# EAGLE design Hardware-Neuron (EAGLE 9.3.0)
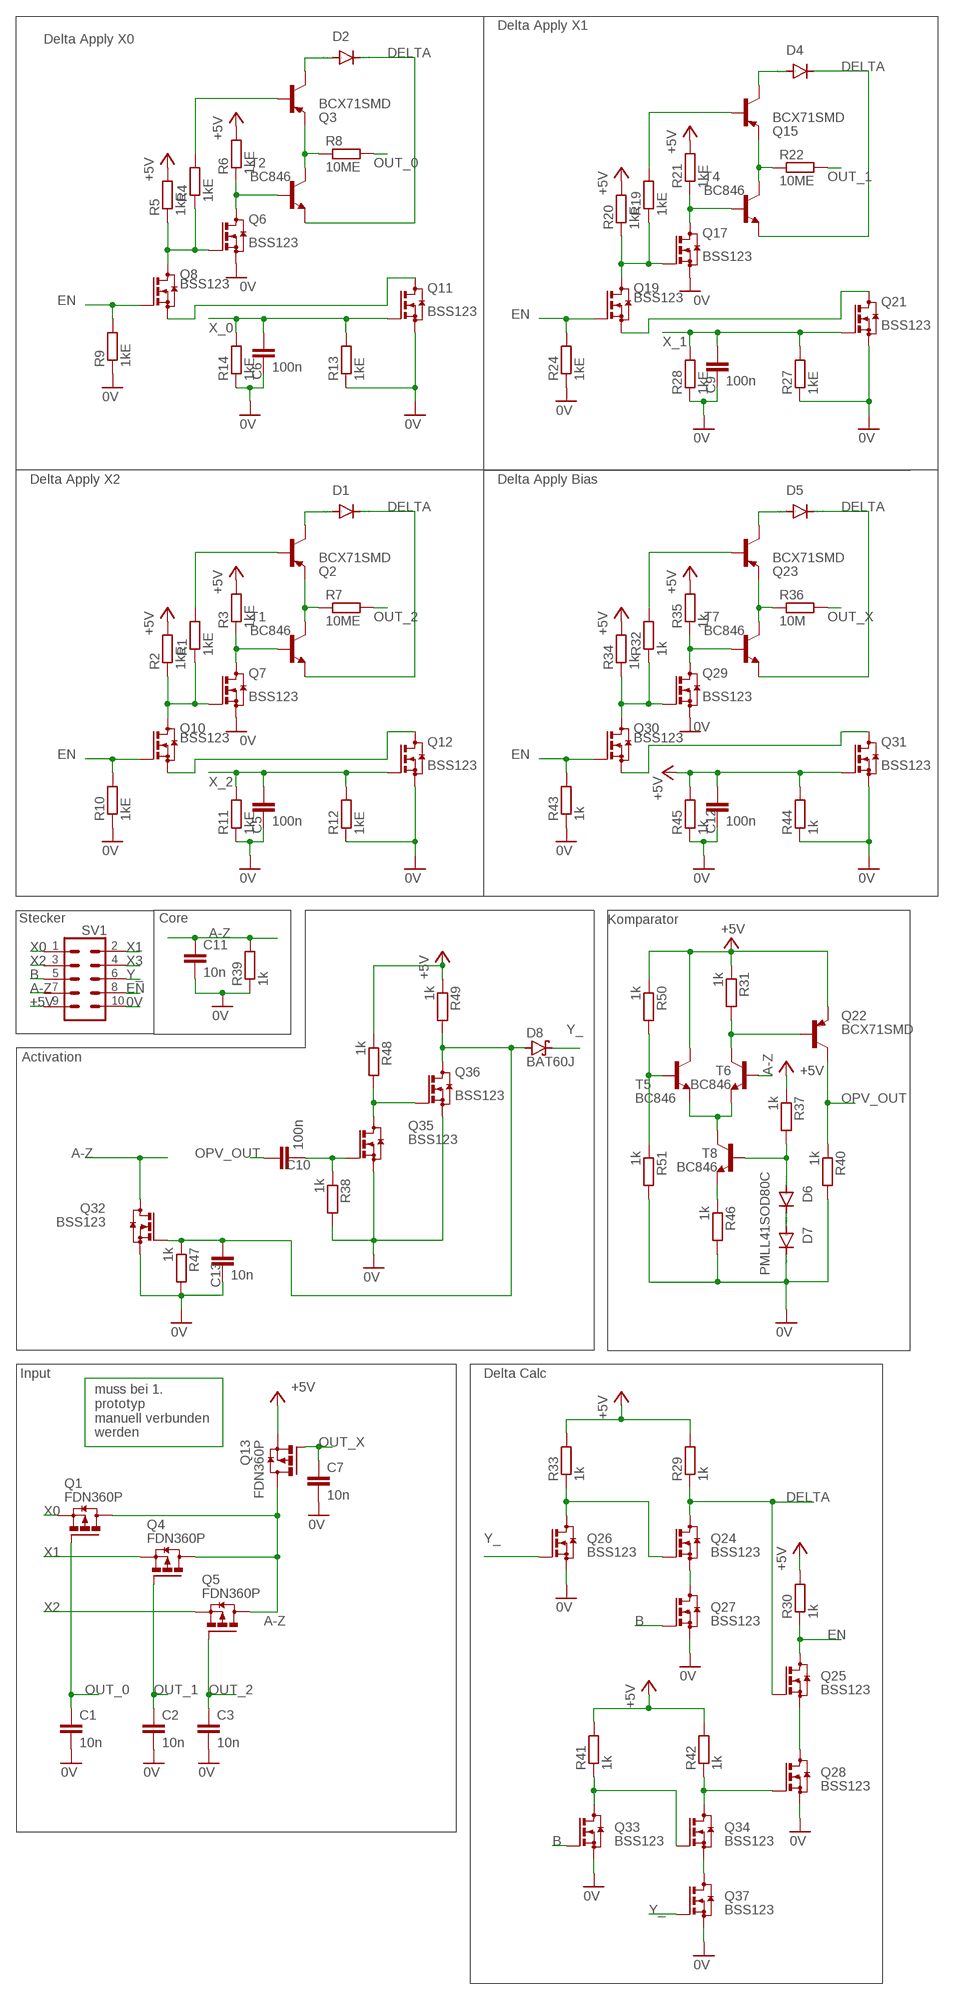
[diagram p0: schematic, sheet 1]

## Parts
C1  10n  C-EUC0805  [C0805]
C2  10n  C-EUC0805  [C0805]
C3  10n  C-EUC0805  [C0805]
C5  100n  C-EUC0805  [C0805]
C6  100n  C-EUC0805  [C0805]
C7  10n  C-EUC0805  [C0805]
C9  100n  C-EUC0805  [C0805]
C10  100n  C-EUC0805  [C0805]
C11  10n  C-EUC0805  [C0805]
C12  100n  C-EUC0805  [C0805]
C13  10n  C-EUC0805  [C0805]
D1  PMLL41SOD80C  [SOD80C]
D2  PMLL41SOD80C  [SOD80C]
D4  PMLL41SOD80C  [SOD80C]
D5  PMLL41SOD80C  [SOD80C]
D6  PMLL41SOD80C  [SOD80C]
D7  PMLL41SOD80C  [SOD80C]
D8  BAT60J  [SOD323_ST]
Q1  FDN360P  [SUPER-SOT3]
Q2  BCX71SMD  [SOT23]
Q3  BCX71SMD  [SOT23]
Q4  FDN360P  [SUPER-SOT3]
Q5  FDN360P  [SUPER-SOT3]
Q6  BSS123  [SOT23]
Q7  BSS123  [SOT23]
Q8  BSS123  [SOT23]
Q10  BSS123  [SOT23]
Q11  BSS123  [SOT23]
Q12  BSS123  [SOT23]
Q13  FDN360P  [SUPER-SOT3]
Q15  BCX71SMD  [SOT23]
Q17  BSS123  [SOT23]
Q19  BSS123  [SOT23]
Q21  BSS123  [SOT23]
Q22  BCX71SMD  [SOT23]
Q23  BCX71SMD  [SOT23]
Q24  BSS123  [SOT23]
Q25  BSS123  [SOT23]
Q26  BSS123  [SOT23]
Q27  BSS123  [SOT23]
Q28  BSS123  [SOT23]
Q29  BSS123  [SOT23]
Q30  BSS123  [SOT23]
Q31  BSS123  [SOT23]
Q32  BSS123  [SOT23]
Q33  BSS123  [SOT23]
Q34  BSS123  [SOT23]
Q35  BSS123  [SOT23]
Q36  BSS123  [SOT23]
Q37  BSS123  [SOT23]
R1  1kE  R-EU_M0805  [M0805]
R2  1kE  R-EU_M0805  [M0805]
R3  1kE  R-EU_M0805  [M0805]
R4  1kE  R-EU_M0805  [M0805]
R5  1kE  R-EU_M0805  [M0805]
R6  1kE  R-EU_M0805  [M0805]
R7  10ME  R-EU_M0805  [M0805]
R8  10ME  R-EU_M0805  [M0805]
R9  1kE  R-EU_M0805  [M0805]
R10  1kE  R-EU_M0805  [M0805]
R11  1kE  R-EU_M0805  [M0805]
R12  1kE  R-EU_M0805  [M0805]
R13  1kE  R-EU_M0805  [M0805]
R14  1kE  R-EU_M0805  [M0805]
R19  1kE  R-EU_M0805  [M0805]
R20  1kE  R-EU_M0805  [M0805]
R21  1kE  R-EU_M0805  [M0805]
R22  10ME  R-EU_M0805  [M0805]
R24  1kE  R-EU_M0805  [M0805]
R27  1kE  R-EU_M0805  [M0805]
R28  1kE  R-EU_M0805  [M0805]
R29  1k  R-EU_M0805  [M0805]
R30  1k  R-EU_M0805  [M0805]
R31  1k  R-EU_M0805  [M0805]
R32  1k  R-EU_M0805  [M0805]
R33  1k  R-EU_M0805  [M0805]
R34  1k  R-EU_M0805  [M0805]
R35  1k  R-EU_M0805  [M0805]
R36  10M  R-EU_M0805  [M0805]
R37  1k  R-EU_M0805  [M0805]
R38  1k  R-EU_M0805  [M0805]
R39  1k  R-EU_M0805  [M0805]
R40  1k  R-EU_M0805  [M0805]
R41  1k  R-EU_M0805  [M0805]
R42  1k  R-EU_M0805  [M0805]
R43  1k  R-EU_M0805  [M0805]
R44  1k  R-EU_M0805  [M0805]
R45  1k  R-EU_M0805  [M0805]
R46  1k  R-EU_M0805  [M0805]
R47  1k  R-EU_M0805  [M0805]
R48  1k  R-EU_M0805  [M0805]
R49  1k  R-EU_M0805  [M0805]
R50  1k  R-EU_M0805  [M0805]
R51  1k  R-EU_M0805  [M0805]
SV1  ML10  [ML10]
T1  BC846  [SOT23]
T2  BC846  [SOT23]
T4  BC846  [SOT23]
T5  BC846  [SOT23]
T6  BC846  [SOT23]
T7  BC846  [SOT23]
T8  BC846  [SOT23]

## Nets
0V: C1.2 C2.2 C3.2 C5.2 C6.2 C7.2 C9.2 C11.2 C12.2 C13.2 D7.C Q6.2(S) Q7.2(S) Q11.2(S) Q12.2(S) Q17.2(S) Q21.2(S) Q26.2(S) Q27.2(S) Q28.2(S) Q29.2(S) Q31.2(S) Q32.2(S) Q33.2(S) Q35.2(S) Q36.2(S) Q37.2(S) R9.1 R10.1 R11.1 R12.1 R13.1 R14.1 R24.1 R27.1 R28.1 R38.2 R39.1 R40.2 R43.1 R44.1 R45.1 R46.2 R47.2 R51.2 SV1.10
+5V: C12.1 Q13.2(S) Q22.2(E) Q31.1(G) R2.2 R3.2 R5.2 R6.2 R20.2 R21.2 R29.2 R30.2 R31.1 R33.2 R34.2 R35.2 R37.1 R41.2 R42.2 R44.2 R45.2 R48.1 R49.1 R50.1 SV1.9 T5.3(C)
A-Z: C11.1 Q1.3(D) Q4.3(D) Q5.3(D) Q13.3(D) Q32.3(D) R39.2 SV1.7 T6.1(B)
B: Q27.1(G) Q33.1(G) SV1.5
DELTA: D1.C D2.C D4.C D5.C Q24.3(D) Q25.1(G) R29.1 T1.2(E) T2.2(E) T4.2(E) T7.2(E)
EN: Q8.1(G) Q10.1(G) Q19.1(G) Q25.3(D) Q30.1(G) R9.2 R10.2 R24.2 R30.1 R43.2 SV1.8
N$1: Q29.3(D) R35.1 T7.1(B)
N$2: Q23.2(E) R36.1 T7.3(C)
N$3: C10.2 Q35.1(G) R38.1
N$5: Q35.3(D) Q36.1(G) R48.2
N$6: Q6.3(D) R6.1 T2.1(B)
N$7: Q8.2(S) Q11.3(D)
N$8: Q3.2(E) R8.1 T2.3(C)
N$9: D5.A Q23.3(C)
N$10: Q23.1(B) R32.2
N$11: Q29.1(G) Q30.3(D) R32.1 R34.1
N$12: Q30.2(S) Q31.3(D)
N$13: D6.C D7.A
N$14: R50.2 R51.1 T5.1(B)
N$16: C13.1 D8.A Q32.1(G) Q36.3(D) R47.1 R49.2
N$25: R46.1 T8.2(E)
N$26: Q22.1(B) R31.2 T6.3(C)
N$27: T5.2(E) T6.2(E) T8.3(C)
N$28: Q17.3(D) R21.1 T4.1(B)
N$29: D6.A R37.2 T8.1(B)
N$30: Q24.1(G) Q26.3(D) R33.1
N$31: D2.A Q3.3(C)
N$32: Q24.2(S) Q27.3(D)
N$33: Q15.2(E) R22.1 T4.3(C)
N$34: Q3.1(B) R4.2
N$35: Q6.1(G) Q8.3(D) R4.1 R5.1
N$36: Q28.1(G) Q34.3(D) R42.1
N$37: Q33.3(D) Q34.1(G) R41.1
N$38: D4.A Q15.3(C)
N$39: Q15.1(B) R19.2
N$40: Q25.2(S) Q28.3(D)
N$41: Q17.1(G) Q19.3(D) R19.1 R20.1
N$42: Q19.2(S) Q21.3(D)
N$43: Q34.2(S) Q37.3(D)
N$50: Q7.3(D) R3.1 T1.1(B)
N$51: Q2.2(E) R7.1 T1.3(C)
N$52: D1.A Q2.3(C)
N$53: Q2.1(B) R1.2
N$54: Q7.1(G) Q10.3(D) R1.1 R2.1
N$55: Q10.2(S) Q12.3(D)
OPV_OUT: C10.1 Q22.3(C) R40.1
OUT_0: C1.1 Q1.1(G) R8.2
OUT_1: C2.1 Q4.1(G) R22.2
OUT_2: C3.1 Q5.1(G) R7.2
OUT_X: C7.1 Q13.1(G) R36.2
X0: Q1.2(S) SV1.1
X1: Q4.2(S) SV1.2
X2: Q5.2(S) SV1.3
X3: SV1.4
X_0: C6.1 Q11.1(G) R13.2 R14.2
X_1: C9.1 Q21.1(G) R27.2 R28.2
X_2: C5.1 Q12.1(G) R11.2 R12.2
Y_: D8.C Q26.1(G) Q37.1(G) SV1.6

## Notes on the sheet
- Delta Apply X1
- Delta Apply X0
- Delta Apply X2 | Delta Apply Bias
- Stecker | Core | Komparator
- Activation
- Input | Delta Calc
- muss bei 1.
  prototyp 
  manuell verbunden
  werden

## Library data of the parts
C1-C3 C5-C7 C9-C13 = rcl:C-EU: CAPACITOR, European symbol; SPICEPREFIX: C
D1 D2 D4-D7 = diode:PMLL41*: High-speed diodes Source: http://www.semiconductors.philips.com/acrobat_download/datasheets/PMLL4150_2.pdf
D8 = diode:BAT60J: Schottky barrier diode Source: www.st.com, BAT60J.pdf
Q1 Q4 Q5 Q13 = transistor-power:FDN360P: Single P-Channel, PowerTrench (R) MOSFET Source: http://www.fairchildsemi.com/ds/FD/FDN360P.pdf
Q2 Q3 Q15 Q22 Q23 = transistor-pnp:BCX71SMD: PNP Transistor
Q6-Q8 Q10-Q12 Q17 Q19 Q21 Q24-Q37 = transistor-small-signal:BSS123: N-CHANNEL MOS FET
R1-R14 R19-R22 R24 R27-R51 = rcl:R-EU_: RESISTOR, European symbol; SPICEPREFIX: R
SV1 = con-harting-ml:ML10: HARTING; OC_FARNELL: unknown; OC_NEWARK: unknown
T1 T2 T4-T8 = transistor:BC846: NPN TRANSISTOR

## Board
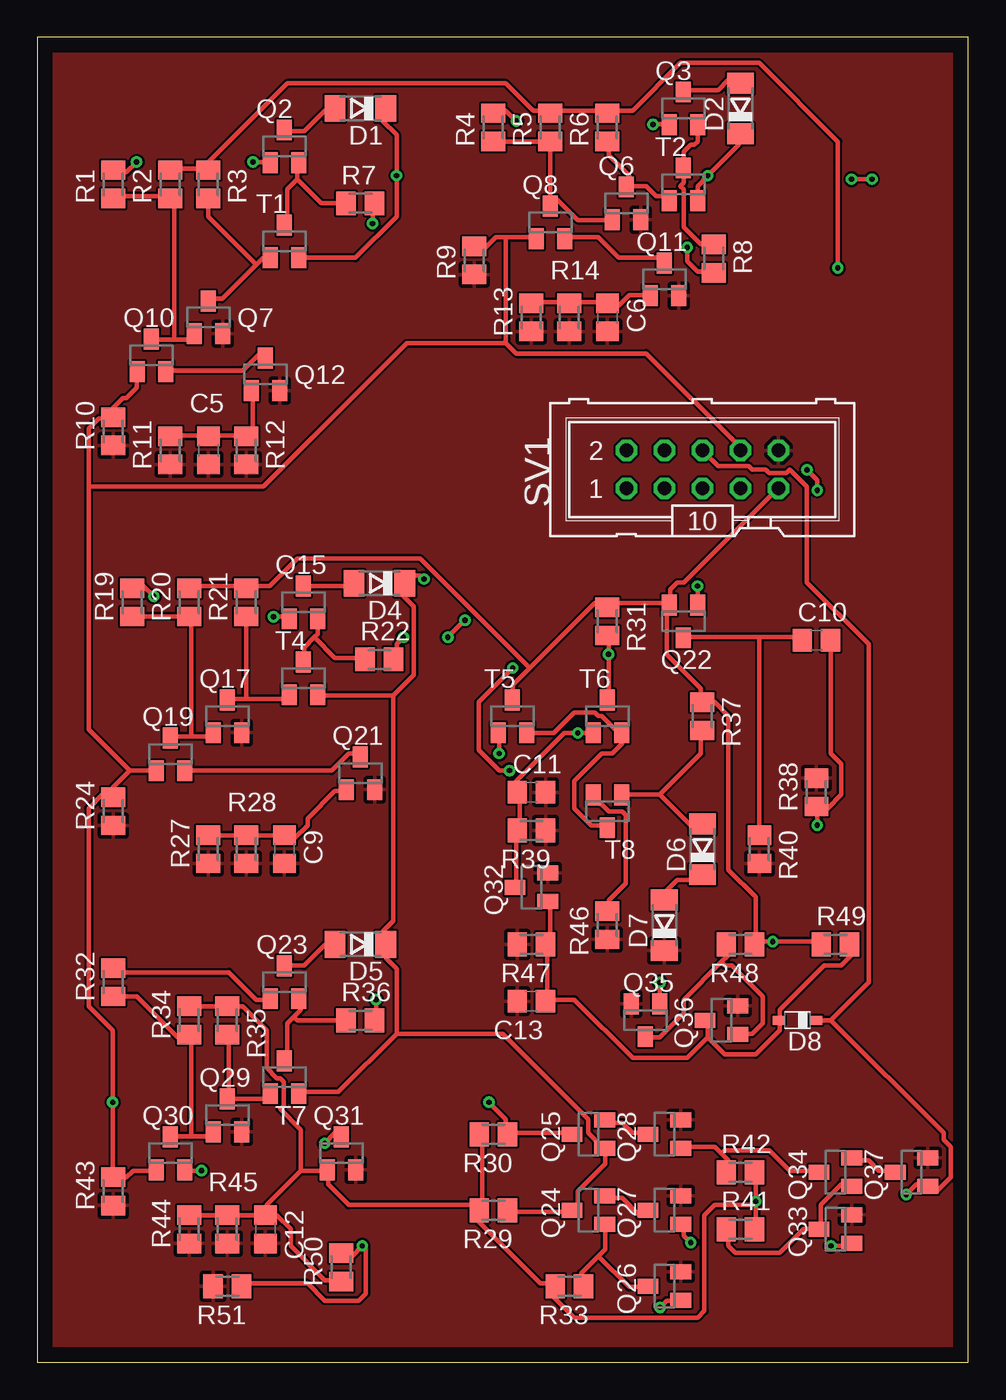
[diagram p1: board, top side]
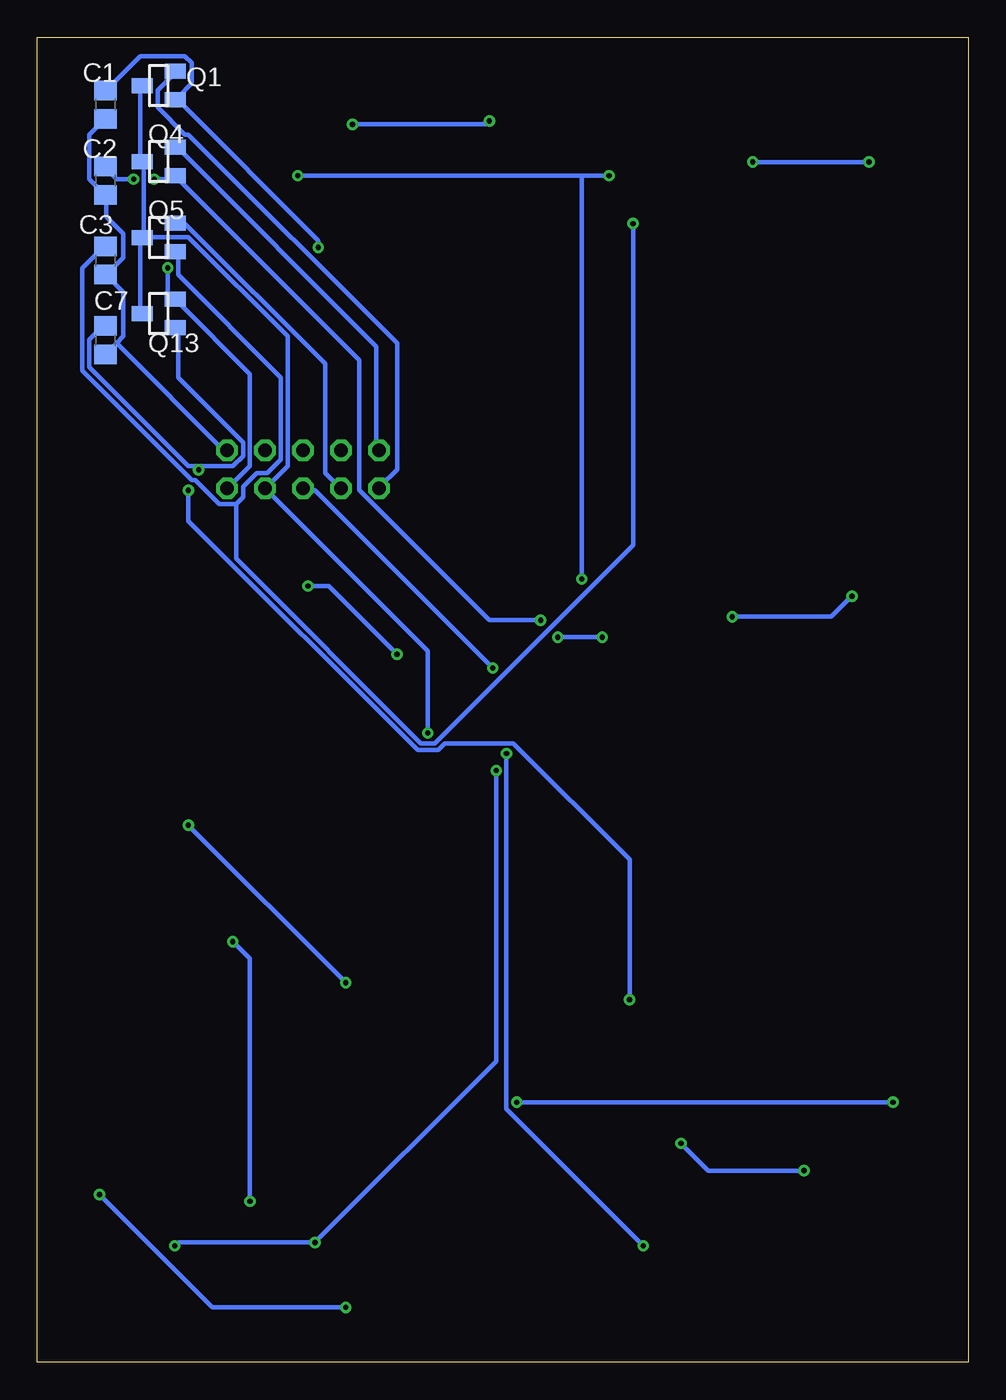
[diagram p2: board, bottom side, seen from below]

Size 62.21 x 88.57 mm. Coordinates in mm from the lower left corner, seen from the top.
Outline: 0,0 62.21,0 62.21,88.57 0,88.57 0,0
Copper layers (1*16): Top 0.035mm / dielectric 1.5mm / Bottom 0.035mm
Design rules "default *": minimum track width 12mil, minimum drill 0.35mm, track to track 6mil, track to pad 6mil, pad to pad 6mil, via to via 6mil, smd to smd 6mil, copper to edge 40mil, drill to drill 6mil, minimum pad ring 10mil, minimum via ring 8mil, stop-mask expansion 4mil, vias tented up to drill 0mil, thermal gap 10mil

### Footprints (pad centres in the part's own frame; a part is rotated, then mirrored left to right if it is on the bottom)
C0805 = smd 1.3 x 1.5: 1 -0.95,0; 2 0.95,0
SOD80C = smd 1.4 x 1.8: A 1.7,0; C -1.7,0
SOD323_ST = smd 0.8 x 0.6: A 1.25,0; C -1.25,0
SUPER-SOT3 = smd 1 x 1.4: 1 -0.95,-1.1; 2 0.95,-1.1; 3 0,1.1
SOT23 = smd 1 x 1.4: 1 -0.95,-1.1; 2 0.95,-1.1; 3 0,1.1
M0805 = smd 1.3 x 1.6: 1 -0.95,0; 2 0.95,0
ML10 = drill 0.914 octagon: 1 -5.08,-1.27; 2 -5.08,1.27; 3 -2.54,-1.27; 4 -2.54,1.27; 5 0,-1.27; 6 0,1.27; 7 2.54,-1.27; 8 2.54,1.27; 9 5.08,-1.27; 10 5.08,1.27

### Placement (x,y rotation side)
C1  57.66,84.07 270 bottom
C2  57.66,78.99 270 bottom
C3  57.66,73.66 270 bottom
C5  11.43,60.96 270 top
C6  38.1,69.85 270 top
C7  57.66,68.33 270 bottom
C9  16.51,34.29 270 top
C10  52.07,48.26 0 top
C11  33.02,38.1 0 top
C12  15.24,8.89 270 top
C13  33.02,24.13 180 top
D1  21.59,83.82 180 top
D2  46.99,83.82 90 top
D4  22.86,52.07 180 top
D5  21.59,27.94 180 top
D6  44.45,34.29 90 top
D7  41.91,29.21 90 top
D8  50.8,22.86 180 top
Q1  54.1,85.34 90 bottom
Q2  16.51,81.28 0 top
Q3  43.18,83.82 0 top
Q4  54.1,80.26 90 bottom
Q5  54.1,75.18 90 bottom
Q6  39.37,77.47 0 top
Q7  11.43,69.85 0 top
Q8  34.29,76.2 0 top
Q10  7.62,67.31 0 top
Q11  41.91,72.39 0 top
Q12  15.24,66.04 0 top
Q13  54.1,70.1 90 bottom
Q15  17.78,50.8 0 top
Q17  12.7,43.18 0 top
Q19  8.89,40.64 0 top
Q21  21.59,39.37 0 top
Q22  43.18,49.53 180 top
Q23  16.51,25.4 0 top
Q24  36.83,10.16 90 top
Q25  36.83,15.24 90 top
Q26  41.91,5.08 90 top
Q27  41.91,10.16 90 top
Q28  41.91,15.24 90 top
Q29  12.7,16.51 0 top
Q30  8.89,13.97 0 top
Q31  20.32,13.97 0 top
Q32  33.02,31.75 90 top
Q33  53.34,8.89 90 top
Q34  53.34,12.7 90 top
Q35  40.64,22.86 180 top
Q36  45.72,22.86 90 top
Q37  58.42,12.7 90 top
R1  5.08,78.74 90 top
R2  8.89,78.74 90 top
R3  11.43,78.74 90 top
R4  30.48,82.55 90 top
R5  34.29,82.55 90 top
R6  38.1,82.55 90 top
R7  21.59,77.47 0 top
R8  45.21,73.79 270 top
R9  29.21,73.66 90 top
R10  5.08,62.23 90 top
R11  8.89,60.96 90 top
R12  13.97,60.96 90 top
R13  33.02,69.85 90 top
R14  35.56,69.85 90 top
R19  6.35,50.8 90 top
R20  10.16,50.8 90 top
R21  13.97,50.8 90 top
R22  22.86,46.99 0 top
R24  5.08,36.83 90 top
R27  11.43,34.29 90 top
R28  13.97,34.29 90 top
R29  30.48,10.16 180 top
R30  30.48,15.24 180 top
R31  38.1,49.53 270 top
R32  5.08,25.4 90 top
R33  35.56,5.08 180 top
R34  10.16,22.86 90 top
R35  12.7,22.86 90 top
R36  21.59,22.86 0 top
R37  44.45,43.18 270 top
R38  52.07,38.1 90 top
R39  33.02,35.56 180 top
R40  48.26,34.29 270 top
R41  46.99,8.89 0 top
R42  46.99,12.7 0 top
R43  5.08,11.43 90 top
R44  10.16,8.89 90 top
R45  12.7,8.89 90 top
R46  38.1,29.21 270 top
R47  33.02,27.94 180 top
R48  46.99,27.94 180 top
R49  53.34,27.94 0 top
R50  20.32,6.35 90 top
R51  12.7,5.08 180 top
SV1  44.45,59.69 0 top
T1  16.51,74.93 0 top
T2  43.18,78.74 0 top
T4  17.78,45.72 0 top
T5  31.75,43.18 0 top
T6  38.1,43.18 0 top
T7  16.51,19.05 0 top
T8  38.1,36.83 180 top

### Tracks (layer width: path | path; a pad name or v marks a point on that pad's centre or on a via)
0V
  Bottom 0.305: C1.2 57.84,82.98 58.75,82.07 58.75,79.1 57.84,78.18 C2.2 57.61,77.95 57.61,76.58 56.46,75.44 56.46,73.84 57.61,72.69 | 56.92,68.12 56.46,68.58 56.46,71.55 57.61,72.69 | 56.92,68.12 57.61,67.44 C7.2 | 57.61,72.69 C3.2 | 56.92,68.12 49.61,60.81 SV1.10
  pour Top: -2.54,-2.54 64.77,-2.54 64.77,91.44 -2.54,91.44
+5V  (via drill 0.35)
  Top 0.305: R34.2 10.29,23.77 12.57,23.77 R35.2 12.8,23.77 13.72,23.77 15.32,22.17 15.32,19.66 16,18.97 16.23,18.97 16.46,18.75 16.46,17.14 16.23,16.92 17.6,15.54 17.6,12.8 | R44.2 10.29,9.83 12.57,9.83 R45.2 12.8,9.83 15.09,9.83 C12.1 | 17.6,12.8 19.2,12.8 Q31.1 19.43,12.8 19.43,11.89 20.8,10.52 29.72,10.52 | 17.6,12.8 15.32,10.52 15.32,10.06 C12.1 | R50.1 20.12,5.49 19.2,5.49 16.92,7.77 16.92,8.91 16,9.83 15.32,9.83 C12.1 | 48.01,10.52 v48.01,10.74 48.01,12.57 R42.2 | 48.01,10.52 48.01,8.91 R41.2 | 29.72,10.52 29.72,15.09 R30.2 | 29.72,10.52 29.72,10.29 R29.2 | R29.2 29.49,10.06 29.49,9.37 33.6,5.26 34.52,5.26 R33.2 34.52,5.03 34.52,4.34 35.89,2.97 44.12,2.97 44.58,3.43 44.58,9.83 45.26,10.52 48.01,10.52 | 29.72,10.52 R29.2 | 11.43,79.78 8.91,79.78 R2.2 | 34.29,83.67 37.95,83.67 R6.2 38.18,83.67 39.78,83.67 42.98,86.87 48.23,86.87 53.49,81.61 v53.49,73.15 | 11.43,79.78 11.43,80.24 16.69,85.5 31.32,85.5 33.15,83.67 34.29,83.67 | 11.43,79.78 R3.2 | 34.29,83.67 R5.2 | 48.01,28.12 v49.15,28.12 52.35,28.12 R49.1 | R20.2 10.29,51.89 13.95,51.89 R21.2 14.17,51.89 15.54,51.89 17.37,53.72 25.6,53.72 32.92,46.41 | 32.92,46.41 37.26,50.75 37.72,50.75 37.95,50.52 R31.1 38.18,50.52 38.41,50.75 42.06,50.75 Q22.2 | 32.92,46.41 31.77,45.26 31.77,44.35 T5.3 | Q22.2 42.06,50.52 42.06,47.32 44.35,45.03 44.35,44.35 R37.1 44.58,44.12 45.26,44.12 46.18,43.2 46.18,32.92 48.01,31.09 48.01,28.12 | 48.01,28.12 R48.1 | SV1.9 49.38,58.29 43.2,52.12 42.75,52.12 42.29,51.66 42.29,50.75 Q22.2
  Bottom 0.305: SV1.9 49.38,58.52 48.01,59.89 48.01,66.06 52.81,70.87 Q13.2 53.03,71.09 53.49,71.55 v53.49,73.15 | v48.01,10.74 48.01,26.98 v49.15,28.12
A-Z  (via drill 0.35)
  Top 0.305: Q32.3 32,31.77 32,35.43 R39.2 32.23,35.66 32.23,37.95 C11.1 32,38.18 32,38.86 35.2,42.06 v36.12,42.06 37.03,42.06 T6.1
  Bottom 0.305: Q1.3 55.32,85.27 55.32,80.47 Q4.3 55.09,80.24 55.09,75.21 | Q13.3 55.32,70.18 55.32,74.98 Q5.3 55.09,75.21 | 55.09,75.21 52.12,75.21 45.49,68.58 45.49,59.89 46.86,58.52 SV1.7 36.12,47.55 v36.12,42.06
B  (via drill 0.35)
  Top 0.305: v43.66,8 43.2,8.46 43.2,9.14 Q27.1 | v53.03,7.77 54.41,7.77 Q33.1 | v31.77,46.41 29.49,44.12 29.49,40.92 30.86,39.55 v31.55,39.55
  Bottom 0.305: v53.03,7.77 52.81,8 v43.66,8 31.55,20.12 v31.55,39.55 | v31.77,46.41 43.66,58.29 44.35,58.29 SV1.5
DELTA  (via drill 0.35)
  Top 0.305: T2.2 44.12,77.72 44.12,78.64 v44.81,79.32 46.86,81.38 46.86,82.07 D2.C | T1.2 17.6,73.84 21.26,73.84 24,76.58 v24,79.32 24,82.07 23.09,82.98 23.09,83.67 D1.C | 23.77,44.58 18.75,44.58 T4.2 | 23.77,44.58 25.15,45.95 25.15,50.52 24.46,51.21 24.46,51.89 D4.C 24.69,52.12 25.15,52.58 25.6,52.58 v25.83,52.35 | R29.1 31.55,10.06 35.66,10.06 Q24.3 35.89,10.06 36.12,10.29 36.12,11.43 37.95,13.26 37.95,14.17 Q25.1 37.72,14.4 36.8,15.32 36.8,16.23 31.09,21.95 24,21.95 | 24,21.95 20.12,18.06 17.6,18.06 T7.2 | 24,21.95 24,26.29 23.32,26.98 23.32,27.89 D5.C 23.09,28.12 23.09,28.8 23.77,29.49 23.77,44.58
  Bottom 0.305: v24,79.32 25.83,79.32 | 25.83,79.32 v44.81,79.32 | v25.83,52.35 25.83,79.32
EN  (via drill 0.35)
  Top 0.305: 31.32,75.21 30.63,75.21 29.95,74.52 29.26,74.52 R9.2 | 31.32,75.21 33.15,75.21 Q8.1 | 31.32,68.12 32,67.44 40.69,67.44 46.86,61.27 46.86,61.04 SV1.8 | 31.32,75.21 31.32,68.12 | Q10.1 6.63,66.06 6.63,65.15 5.94,64.47 5.71,64.47 5.03,63.78 5.03,63.32 R10.2 5.03,63.09 4.12,63.09 3.43,62.41 3.43,58.52 | Q25.3 35.66,15.32 31.55,15.32 R30.1 31.32,15.32 31.32,16.23 v30.18,17.37 | Q30.1 7.77,12.8 6.4,12.8 5.94,12.34 5.26,12.34 R43.2 5.03,12.57 v5.03,17.37 5.03,22.17 3.43,23.77 3.43,37.03 4.34,37.95 5.03,37.95 | 6.17,39.55 7.77,39.55 Q19.1 | 6.17,39.55 5.03,38.41 5.03,37.95 | 5.03,37.95 R24.2 | 3.43,58.52 3.43,42.29 6.17,39.55 | 31.32,68.12 24.69,68.12 15.09,58.52 3.43,58.52
  Bottom 0.305: v5.03,17.37 v30.18,17.37
N$1
  Top 0.305: T7.1 15.54,17.83 15.32,17.6 12.8,17.6 Q29.3 12.8,17.83 12.8,21.72 R35.1
N$2
  Top 0.305: 17.14,23.09 17.6,23.55 17.6,24.23 Q23.2 | 17.14,23.09 16.69,22.63 16.69,20.34 T7.3 | R36.1 17.37,22.86 17.14,23.09
N$3  (via drill 0.35)
  Top 0.305: v41.6,25.38 41.6,24 Q35.1 | 52.12,37.03 v52.12,35.89 | 52.12,37.03 52.81,37.03 53.72,37.95 53.72,40.01 53.03,40.69 53.03,48.23 C10.2 | 52.12,37.03 R38.1
  Bottom 0.305: v52.12,35.89 v41.6,25.38
N$5
  Top 0.305: 45.72,26.75 46.18,27.2 46.18,27.89 R48.2 | 45.72,26.75 43.2,24.23 43.2,23.32 41.6,21.72 40.69,21.72 Q35.3 | 45.72,26.75 45.95,26.52 46.41,26.52 48.46,24.46 48.46,22.63 47.78,21.95 46.86,21.95 Q36.1
N$6
  Top 0.305: 39.55,78.64 40.69,78.64 41.38,77.95 42.06,77.95 42.29,77.72 T2.1 | 39.55,78.64 39.55,79.32 38.18,80.7 38.18,81.38 R6.1 | 39.55,78.64 Q6.3
N$7
  Top 0.305: Q8.2 35.43,75.21 37.49,75.21 38.86,73.84 41.6,73.84 41.83,73.61 Q11.3
N$8
  Top 0.305: Q3.2 44.12,82.53 44.12,81.61 43.89,81.38 43.66,81.38 43.2,80.92 43.2,80.01 T2.3 43.2,79.78 43.2,78.87 42.98,78.64 43.2,78.41 43.2,75.89 44.35,74.75 45.03,74.75 R8.1
N$9
  Top 0.305: Q23.3 16.69,26.52 17.83,26.52 19.2,27.89 19.89,27.89 D5.A
N$10
  Top 0.305: Q23.1 15.54,24.23 14.63,24.23 12.8,26.06 5.49,26.06 5.26,26.29 R32.2
N$11
  Top 0.305: 10.29,15.09 11.43,15.09 11.66,15.32 Q29.1 | 10.29,15.09 8.91,15.09 Q30.3 | R32.1 5.26,24.46 6.63,24.46 9.37,21.72 10.06,21.72 R34.1 10.29,21.72 10.29,15.09
N$12  (via drill 0.35)
  Top 0.305: v10.97,12.8 10.06,12.8 Q30.2 | v19.2,14.63 19.89,15.32 20.12,15.32 20.34,15.09 Q31.3
  Bottom 0.305: v10.97,12.8 17.37,12.8 v19.2,14.63
N$13
  Top 0.305: D7.A 42.06,31.09 42.06,31.55 42.75,32.23 44.12,32.23 44.35,32.46 D6.C
N$14  (via drill 0.35)
  Top 0.305: v30.86,40.69 30.86,42.06 T5.1 | R50.2 20.34,7.09 21.03,7.09 v21.72,7.77 21.95,7.54 21.95,4.57 21.49,4.12 19.2,4.12 18.06,5.26 13.72,5.26 R51.1
  Bottom 0.305: v30.86,40.69 30.86,16.92 v21.72,7.77
N$16
  Top 0.305: Q32.1 34.29,30.63 34.29,28.35 34.06,28.12 R47.1 34.06,27.89 34.06,24.23 | 49.61,22.86 49.61,23.55 52.58,26.52 53.72,26.52 54.41,27.2 54.41,27.89 R49.2 | 44.81,21.72 44.81,22.86 Q36.3 | 44.81,21.72 45.95,20.57 48.01,20.57 49.61,22.17 49.61,22.86 | 49.61,22.86 D8.A | 34.06,24.23 35.89,24.23 39.78,20.34 43.43,20.34 44.81,21.72 | 34.06,24.23 C13.1
N$25
  Top 0.305: T8.2 37.26,37.72 38.18,36.8 39.09,36.8 39.32,36.58 39.32,32 38.18,30.86 38.18,30.18 R46.1
N$26  (via drill 0.35)
  Top 0.305: T6.3 38.18,44.35 v38.18,47.32 38.18,48.46 R31.2 | v44.12,51.89 44.12,50.75 Q22.1
  Bottom 0.305: v44.12,51.89 42.75,51.89 v38.18,47.32
N$27
  Top 0.305: T5.2 32.92,42.06 34.52,42.06 35.89,43.43 37.26,43.43 37.49,43.2 37.72,43.2 38.86,42.06 T6.2 39.09,42.06 39.09,41.38 38.41,40.69 37.72,40.69 35.89,38.86 35.89,37.03 37.03,35.89 37.95,35.89 T8.3
N$28
  Top 0.305: 13.95,44.35 16.69,44.35 16.92,44.58 T4.1 | 13.95,44.35 12.8,44.35 Q17.3 | 13.95,44.35 13.95,49.84 R21.1
N$29
  Top 0.305: 41.6,37.95 39.09,37.95 T8.1 | 41.6,37.95 43.66,35.89 44.35,35.89 D6.A | 41.6,37.95 44.35,40.69 44.35,42.06 R37.2
N$30
  Top 0.305: 37.49,7.09 36.35,5.94 36.35,5.26 R33.1 | 37.49,7.09 37.95,7.54 37.95,9.14 Q24.1 | 37.49,7.09 39.55,5.03 40.69,5.03 Q26.3
N$31
  Top 0.305: Q3.3 43.2,85.04 45.49,85.04 46.18,85.72 46.86,85.72 D2.A
N$32
  Top 0.305: Q24.2 37.95,10.97 39.09,10.97 40.23,9.83 40.46,9.83 40.69,10.06 Q27.3
N$33
  Top 0.305: 18.52,48.46 18.75,48.69 18.75,49.61 Q15.2 | 18.52,48.46 17.83,47.78 17.83,46.86 T4.3 | 18.52,48.46 19.89,47.09 21.72,47.09 R22.1
N$34  (via drill 0.35)
  Top 0.305: v41.15,82.75 42.06,82.75 Q3.1 | v32,82.98 31.32,83.67 30.63,83.67 R4.2
  Bottom 0.305: v41.15,82.75 32.23,82.75 v32,82.98
N$35
  Top 0.305: 34.29,77.72 R5.1 30.63,81.61 R4.1 | 34.29,77.72 Q8.3 34.29,77.5 | 34.29,77.72 34.75,77.72 36.12,76.35 38.41,76.35 Q6.1
N$36
  Top 0.305: 45.72,13.95 46.18,13.49 46.18,12.8 R42.1 | 45.72,13.95 45.26,14.4 43.2,14.4 Q28.1 | 45.72,13.95 45.95,14.17 48.92,14.17 50.29,12.8 52.12,12.8 Q34.3
N$37
  Top 0.305: Q34.1 54.41,11.89 53.72,11.89 52.35,10.52 52.35,8.91 Q33.3 52.12,8.91 51.21,8.91 49.61,7.32 46.63,7.32 46.18,7.77 46.18,8.69 R41.1
N$38
  Top 0.305: Q15.3 17.83,51.89 21.03,51.89 D4.A
N$39  (via drill 0.35)
  Top 0.305: v15.77,49.84 16.69,49.84 Q15.1 | v7.77,51.21 7.09,51.89 6.4,51.89 R19.2
  Bottom 0.305: v15.77,49.84 9.14,49.84 v7.77,51.21
N$40
  Top 0.305: Q25.2 37.95,16 39.09,16 39.78,15.32 40.69,15.32 Q28.3
N$41
  Top 0.305: 10.29,41.83 11.43,41.83 11.66,42.06 Q17.1 | 10.29,41.83 8.91,41.83 Q19.3 | R19.1 6.4,49.84 10.06,49.84 R20.1 10.29,49.84 10.29,41.83
N$42
  Top 0.305: Q19.2 10.06,39.55 19.66,39.55 20.8,40.69 21.49,40.69 Q21.3
N$43
  Top 0.305: Q34.2 54.63,13.49 55.55,13.49 56.24,12.8 57.15,12.8 Q37.3
N$50
  Top 0.305: 14.63,73.38 15.09,73.84 15.54,73.84 T1.1 | 14.63,73.38 12.34,71.09 11.43,71.09 Q7.3 | R3.1 11.43,76.58 14.63,73.38
N$51
  Top 0.305: 17.37,79.1 16.69,78.41 16.69,76.12 T1.3 | 17.37,79.1 17.37,80.01 Q2.2 | 17.37,79.1 18.97,77.5 20.57,77.5 R7.1
N$52
  Top 0.305: Q2.3 16.69,82.3 17.83,82.3 19.2,83.67 19.89,83.67 D1.A
N$53  (via drill 0.35)
  Top 0.305: v14.4,80.24 15.54,80.24 Q2.1 | v6.63,80.24 5.94,79.55 5.26,79.55 R1.2
  Bottom 0.305: v6.63,80.24 v14.4,80.24
N$54
  Top 0.305: 9.14,68.35 10.29,68.35 10.52,68.58 Q7.1 | 9.14,68.35 7.77,68.35 Q10.3 | R1.1 5.26,77.95 8.69,77.95 R2.1 8.91,77.72 9.14,77.5 9.14,68.35
N$55
  Top 0.305: Q10.2 8.69,66.29 13.72,66.29 14.86,67.44 15.09,67.44 15.32,67.21 Q12.3
OPV_OUT
  Top 0.305: 48.23,48.46 50.98,48.46 C10.1 | 48.23,48.46 43.2,48.46 Q22.3 | 48.23,48.46 48.23,35.43 R40.1
OUT_0  (via drill 0.35)
  Top 0.305: v43.43,74.52 43.43,73.61 44.12,72.92 45.03,72.92 R8.2
  Bottom 0.305: C1.1 57.61,85.04 55.32,87.33 52.35,87.33 51.89,86.87 51.89,85.5 52.81,84.58 Q1.1 52.81,84.35 43.43,74.98 v43.43,74.52
OUT_1  (via drill 0.35)
  Top 0.305: v55.78,79.1 v54.41,79.1 | v24.46,48.46 24,48.01 24,47.09 R22.2 | v28.57,49.61 v27.43,48.46
  Bottom 0.305: v54.41,79.1 53.03,79.1 Q4.1 52.81,79.1 40.69,66.98 40.69,58.29 32,49.61 v28.57,49.61 | v55.78,79.1 56.92,79.1 57.61,79.78 C2.1 | v27.43,48.46 v24.46,48.46
OUT_2  (via drill 0.35)
  Top 0.305: v22.4,76.12 22.4,77.27 R7.2
  Bottom 0.305: 48.92,57.38 48.46,57.84 48.46,58.52 47.55,59.44 46.86,59.44 45.95,60.35 45.95,65.84 52.81,72.69 52.81,74.07 Q5.1 | 48.92,57.38 50.06,57.38 51.66,58.98 51.89,58.98 59.21,66.29 59.21,73.15 57.84,74.52 C3.1 | v22.4,76.12 22.4,54.63 35.66,41.38 36.58,41.38 48.92,53.72 48.92,57.38
OUT_X  (via drill 0.35)
  Top 0.305: v22.63,24.23 22.63,22.86 R36.2 | v52.12,58.29 52.12,58.98 v51.44,59.66
  Bottom 0.305: 51.44,59.89 52.12,59.89 58.75,66.52 58.75,68.35 57.84,69.27 C7.1 | 51.44,59.89 49.15,59.89 48.46,60.58 48.46,61.49 52.81,65.84 52.81,69.04 Q13.1 | v22.63,24.23 22.63,33.6 30.4,41.38 34.98,41.38 35.43,40.92 36.8,40.92 52.12,56.24 v52.12,58.29 | 51.44,59.89 v51.44,59.66
X0
  Bottom 0.305: Q1.2 53.03,86.18 54.18,85.04 54.18,83.9 52.35,82.07 52.12,82.07 38.18,68.12 38.18,59.66 39.32,58.52 SV1.1
X1
  Bottom 0.305: Q4.2 52.81,81.15 39.55,67.89 39.55,61.04 SV1.2
X2
  Bottom 0.305: Q5.2 52.81,76.12 52.35,76.12 42.98,66.75 42.98,59.44 42.06,58.52 SV1.3
X_0
  Top 0.305: R13.2 33.15,70.87 35.43,70.87 R14.2 35.66,70.87 37.95,70.87 C6.1 38.18,70.64 38.86,70.64 39.55,71.32 40.92,71.32 Q11.1
X_1
  Top 0.305: R27.2 11.43,35.2 13.95,35.2 R28.2 14.17,35.2 16.46,35.2 C9.1 16.69,35.2 16.92,34.98 17.14,34.98 18.06,35.89 18.06,36.35 19.89,38.18 20.57,38.18 Q21.1
X_2
  Top 0.305: 11.43,61.95 8.91,61.95 R11.2 | Q12.1 14.4,64.92 14.4,62.18 14.17,61.95 R12.2 13.95,61.95 11.43,61.95 | 11.43,61.95 C5.1
Y_  (via drill 0.35)
  Top 0.305: 53.03,22.86 D8.C | 53.03,22.86 60.58,15.32 60.58,14.86 61.04,14.4 61.04,12.34 60.12,11.43 59.89,11.43 59.66,11.66 Q37.1 59.44,11.89 58.75,11.89 v58.06,11.2 | v41.6,3.66 42.06,4.12 42.98,4.12 Q26.1 | 53.03,22.86 55.55,25.38 55.55,48.01 51.44,52.12 51.44,58.52 50.29,59.66 50.06,59.44 48.92,59.44 48.69,59.66 47.78,59.66 47.55,59.89 45.49,59.89 44.58,60.81 SV1.6
  Bottom 0.305: v41.6,3.66 50.52,3.66 v58.06,11.2